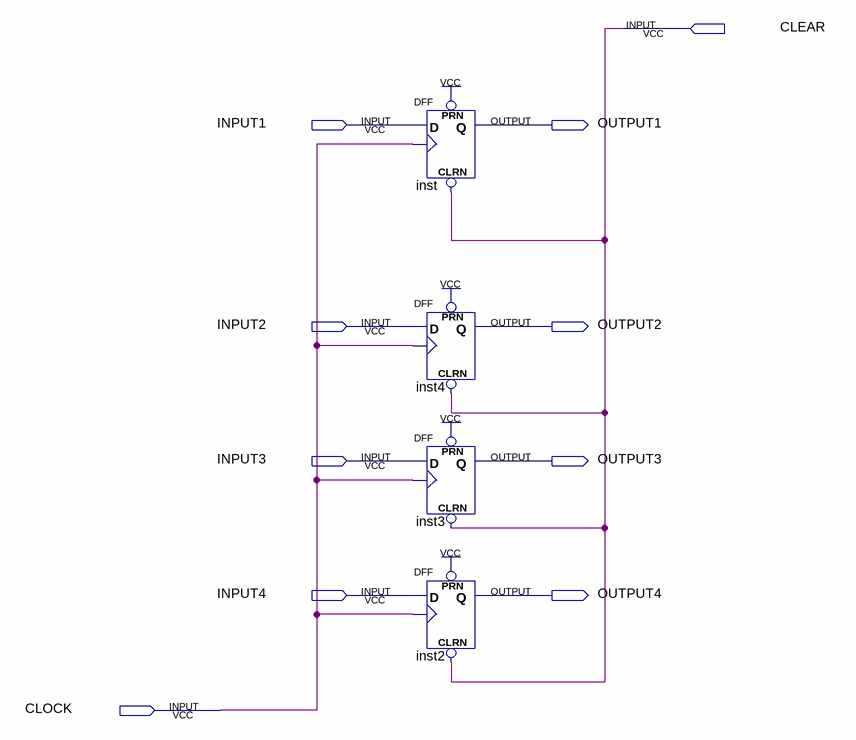
[diagram p0: schematic sheet]
// Quartus schematic Reg4Bit.bdf as structural Verilog: 4 symbols, 10 pins
module Reg4Bit (
  input  CLEAR,
  input  INPUT1,
  input  INPUT2,
  input  INPUT3,
  input  INPUT4,
  input  CLOCK,
  output OUTPUT1,
  output OUTPUT2,
  output OUTPUT3,
  output OUTPUT4
);

  DFF inst (.CLRN(CLEAR), .CLK(CLOCK), .D(INPUT1), .PRN(1'b1), .Q(OUTPUT1));
  DFF inst4 (.CLRN(CLEAR), .CLK(CLOCK), .D(INPUT2), .PRN(1'b1), .Q(OUTPUT2));
  DFF inst3 (.CLRN(CLEAR), .CLK(CLOCK), .D(INPUT3), .PRN(1'b1), .Q(OUTPUT3));
  DFF inst2 (.CLRN(CLEAR), .CLK(CLOCK), .D(INPUT4), .PRN(1'b1), .Q(OUTPUT4));
endmodule
